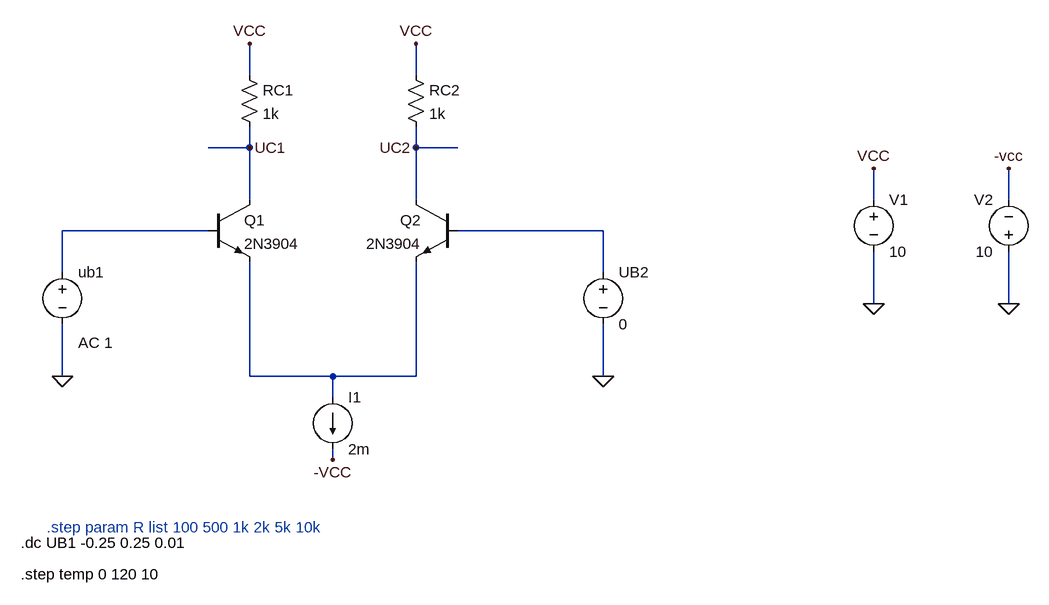
[diagram p0: schematic meros 4o C).asc]
meros 4o C).asc, the LTspice schematic file:
Version 4
SHEET 1 1044 680
WIRE -160 -304 -160 -352
WIRE 96 -304 96 -352
WIRE -160 -192 -160 -224
WIRE -160 -192 -224 -192
WIRE 96 -192 96 -224
WIRE 160 -192 96 -192
WIRE -160 -112 -160 -192
WIRE 96 -112 96 -192
WIRE 800 -112 800 -160
WIRE 1008 -112 1008 -160
WIRE -224 -64 -448 -64
WIRE 384 -64 160 -64
WIRE -448 0 -448 -64
WIRE 384 0 384 -64
WIRE 800 48 800 -32
WIRE 1008 48 1008 -32
WIRE -448 160 -448 80
WIRE -160 160 -160 -16
WIRE -32 160 -160 160
WIRE 96 160 96 -16
WIRE 96 160 -32 160
WIRE 384 160 384 80
WIRE -32 192 -32 160
WIRE -32 288 -32 272
FLAG 800 48 0
FLAG 800 -160 VCC
FLAG 96 -352 VCC
FLAG -160 -352 VCC
FLAG -160 -192 UC1
FLAG 96 -192 UC2
FLAG -32 288 -VCC
FLAG 1008 -160 -vcc
FLAG 1008 48 0
FLAG 384 160 0
FLAG -448 160 0
SYMBOL npn -224 -112 R0
SYMATTR InstName Q1
SYMATTR Value 2N3904
SYMBOL npn 160 -112 M0
SYMATTR InstName Q2
SYMATTR Value 2N3904
SYMBOL res 80 -320 R0
SYMATTR InstName RC2
SYMATTR Value 1k
SYMBOL res -176 -320 R0
SYMATTR InstName RC1
SYMATTR Value 1k
SYMBOL voltage 384 -16 R0
SYMATTR InstName UB2
SYMATTR Value 0
SYMBOL voltage 800 -128 R0
SYMATTR InstName V1
SYMATTR Value 10
SYMBOL current -32 192 R0
SYMATTR InstName I1
SYMATTR Value 2m
SYMBOL voltage -448 -16 R0
WINDOW 123 24 124 Left 2
WINDOW 39 0 0 Left 0
WINDOW 3 24 44 Left 2
SYMATTR Value2 AC 1
SYMATTR Value ""
SYMATTR InstName ub1
SYMBOL voltage 1008 -16 R180
WINDOW 0 24 96 Left 2
WINDOW 3 24 16 Left 2
SYMATTR InstName V2
SYMATTR Value 10
TEXT -472 392 Left 2 ;.step param R list 100 500 1k 2k 5k 10k
TEXT -512 416 Left 2 !.dc UB1 -0.25 0.25 0.01
TEXT -512 464 Left 2 !.step temp 0 120 10

The netlist it stands for:
* meros 4o C).asc
Q1 UC1 N001 N003 0 2N3904
Q2 UC2 N002 N003 0 2N3904
RC2 VCC UC2 1k
RC1 VCC UC1 1k
V§UB2 N002 0 0
V1 VCC 0 10
I1 N003 -VCC 2m
V§ub1 N001 0 AC 1
V2 0 -VCC 10
.model NPN NPN
.model PNP PNP
.lib standard.bjt
* .step param R list 100 500 1k 2k 5k 10k
.dc UB1 -0.25 0.25 0.01
.step temp 0 120 10
.backanno
.end